# EAGLE design ESP8266_BREAKOUT (EAGLE 7.1.0)
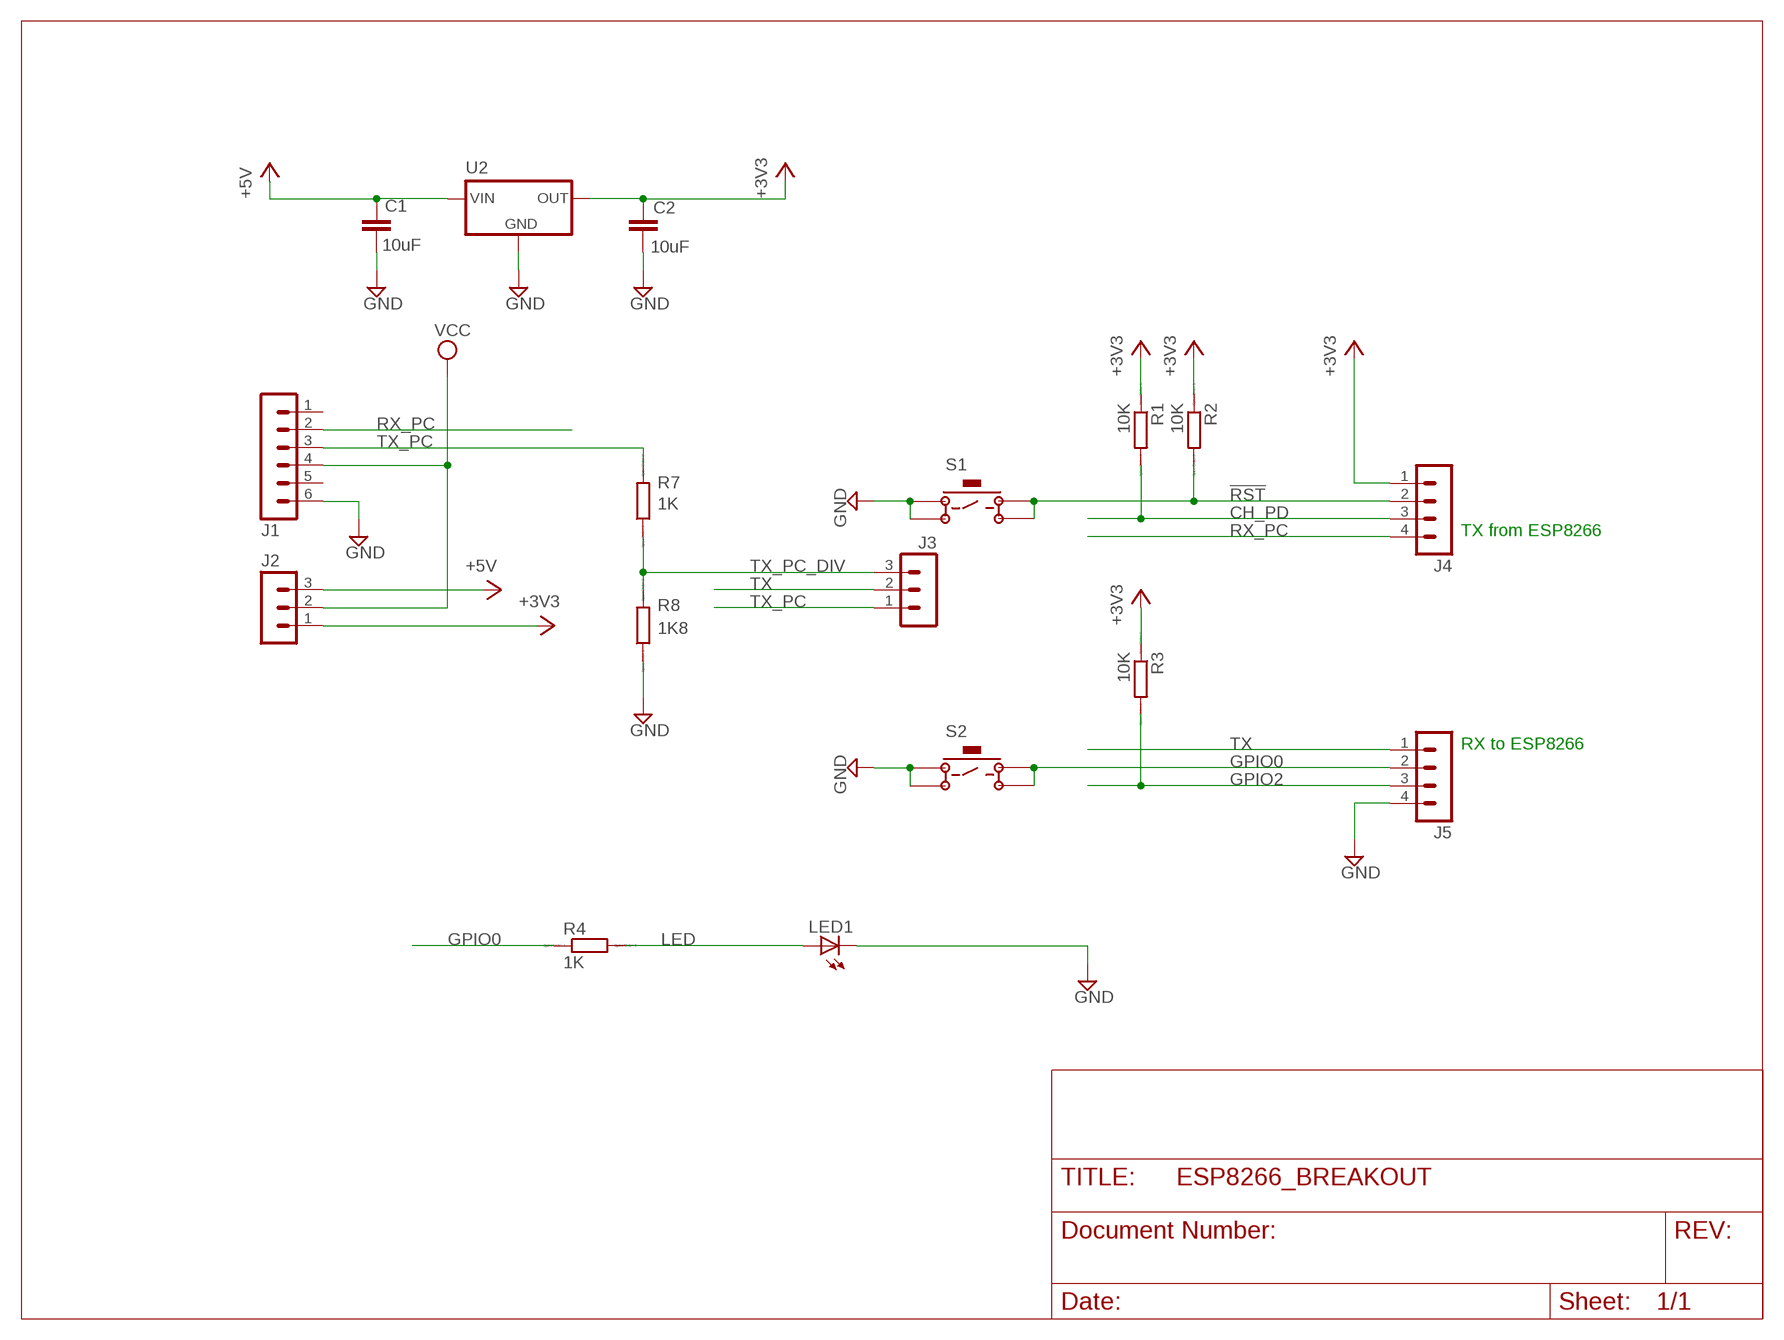
[diagram p0: schematic, sheet 1]

## Parts
C1  10uF  C5/2.5  [C5B2.5]
C2  10uF  C5/2.5  [C5B2.5]
J1  MA06-1  [MA06-1]
J2  MA03-1  [MA03-1]
J3  MA03-1  [MA03-1]
J4  MA04-1  [MA04-1]
J5  MA04-1  [MA04-1]
LED1  LED5MM  [LED5MM]
R1  10K  R-EU_0204_7  [0204/7]
R2  10K  R-EU_0204_7  [0204/7]
R3  10K  R-EU_0204_7  [0204/7]
R4  1K  R-EU_0204_7  [0204/7]
R7  1K  R-EU_0204_7  [0204/7]
R8  1K8  R-EU_0204_7  [0204/7]
S1  1825910-6-SPST-NOPB-4P  [SW-NOPB-4]
S2  1825910-6-SPST-NOPB-4P  [SW-NOPB-4]
U2  LM1117-3V3-T0-220  [TO-220]

## Nets
!RST: J4.2 R2.2 S1.3 S1.4
+3V3: C2.2 J2.1 J4.1 R1.1 R2.1 R3.1 U2.P$2(OUT)
+5V: C1.2 J2.3 U2.P$3(IN)
CH_PD: J4.3 R1.2
GND: C1.1 C2.1 J1.6 J5.4 LED1.K(C) R8.1 S1.1 S1.2 S2.1 S2.2 U2.P$1(GND)
GPIO0: J5.2 R4.1 S2.3 S2.4
GPIO2: J5.3 R3.2
LED: LED1.A R4.2
RX_PC: J1.2 J4.4
TX: J3.2 J5.1
TX_PC: J1.3 J3.1 R7.2
TX_PC_DIV: J3.3 R7.1 R8.2
VCC: J1.4 J2.2
Unconnected: J1.1 J1.5

## Notes on the sheet
- TX from ESP8266
- RX to ESP8266

## Library data of the parts
C1 C2 = capacitor-wima:C: CAPACITOR naming: grid - package width
J1 = con-lstb:MA06-1: PIN HEADER; OC_FARNELL: unknown; OC_NEWARK: unknown
J2 J3 = con-lstb:MA03-1: PIN HEADER; OC_FARNELL: unknown; OC_NEWARK: unknown
J4 J5 = con-lstb:MA04-1: PIN HEADER; OC_FARNELL: unknown; OC_NEWARK: unknown
LED1 = led:LED: LED OSRAM: - CHIPLED LG R971, LG N971, LY N971, LG Q971, LY Q971, LO R971, LY R971 LH N974, LH R974 LS Q976, LO Q976, LY Q976 LO Q996 - Hyper CHIPLED LW Q18S LB Q993, LB Q99A, LB R99A - SideLED LS A670, LO A670, LY A670, LG A670, LP A670 LB A673, LV A673, LT A673, LW A673 LH A674 LY A675 LS A676, LA A676, LO A676, LY A676, LW A676 LS A679, LY A679, LG A679 - Hyper Micro SIDELED® LS Y876, LA Y876, LO Y876, LY Y876 LT Y87S - SmartLED LW L88C, LW L88S LB L89C, LB L89S, LG L890 LS L89K, LO L89K, LY L89K LS L896, LA L896, LO L896, LY L896 - TOPLED LS T670, LO T670, LY T670, LG T670, LP T670 LSG T670, LSP T670, LSY T670, LOP T670, LYG T670 LG T671, LOG T671, LSG T671 LB T673, LV T673, LT T673, LW T673 LH T674 LS T676, LA T676, LO T676, LY T676, LB T676, LH T676, LSB T676, LW T676 LB T67C, LV T67C, LT T67C, LS T67K, LO T67K, LY T67K, LW E67C LS E67B, LA E67B, LO E67B, LY E67B, LB E67C, LV E67C, LT E67C LW T67C LS T679, LY T679, LG T679 LS T770, LO T770, LY T770, LG T770, LP T770 LB T773, LV T773, LT T773, LW T773 LH T774 LS E675, LA E675, LY E675, LS T675 LS T776, LA T776, LO T776, LY T776, LB T776 LHGB T686 LT T68C, LB T68C - Hyper Mini TOPLED® LB M676 - Mini TOPLED Santana® LG M470 LS M47K, LO M47K, LY M47K Source: http://www.osram.convergy.de LUXEON: - LUMILED® LXK2-PW12-R00, LXK2-PW12-S00, LXK2-PW14-U00, LXK2-PW14-V00 LXK2-PM12-R00, LXK2-PM12-S00, LXK2-PM14-U00 LXK2-PE12-Q00, LXK2-PE12-R00, LXK2-PE12-S00, LXK2-PE14-T00, LXK2-PE14-U00 LXK2-PB12-K00, LXK2-PB12-L00, LXK2-PB12-M00, LXK2-PB14-N00, LXK2-PB14-P00, LXK2-PB14-Q00 LXK2-PR12-L00, LXK2-PR12-M00, LXK2-PR14-Q00, LXK2-PR14-R00 LXK2-PD12-Q00, LXK2-PD12-R00, LXK2-PD12-S00 LXK2-PH12-R00, LXK2-PH12-S00 LXK2-PL12-P00, LXK2-PL12-Q00, LXK2-PL12-R00 Source: www.luxeon.com KINGBRIGHT: KA-3528ASYC Source: www.kingbright.com
R1-R4 R7 R8 = resistor:R-EU_: RESISTOR, European symbol; SPICEPREFIX: R
S1 S2 = 1825910-6:1825910-6-SPST-NOPB-4P
U2 = LM1117-3V3-TO220:LM1117-3V3-T0-220

## Board
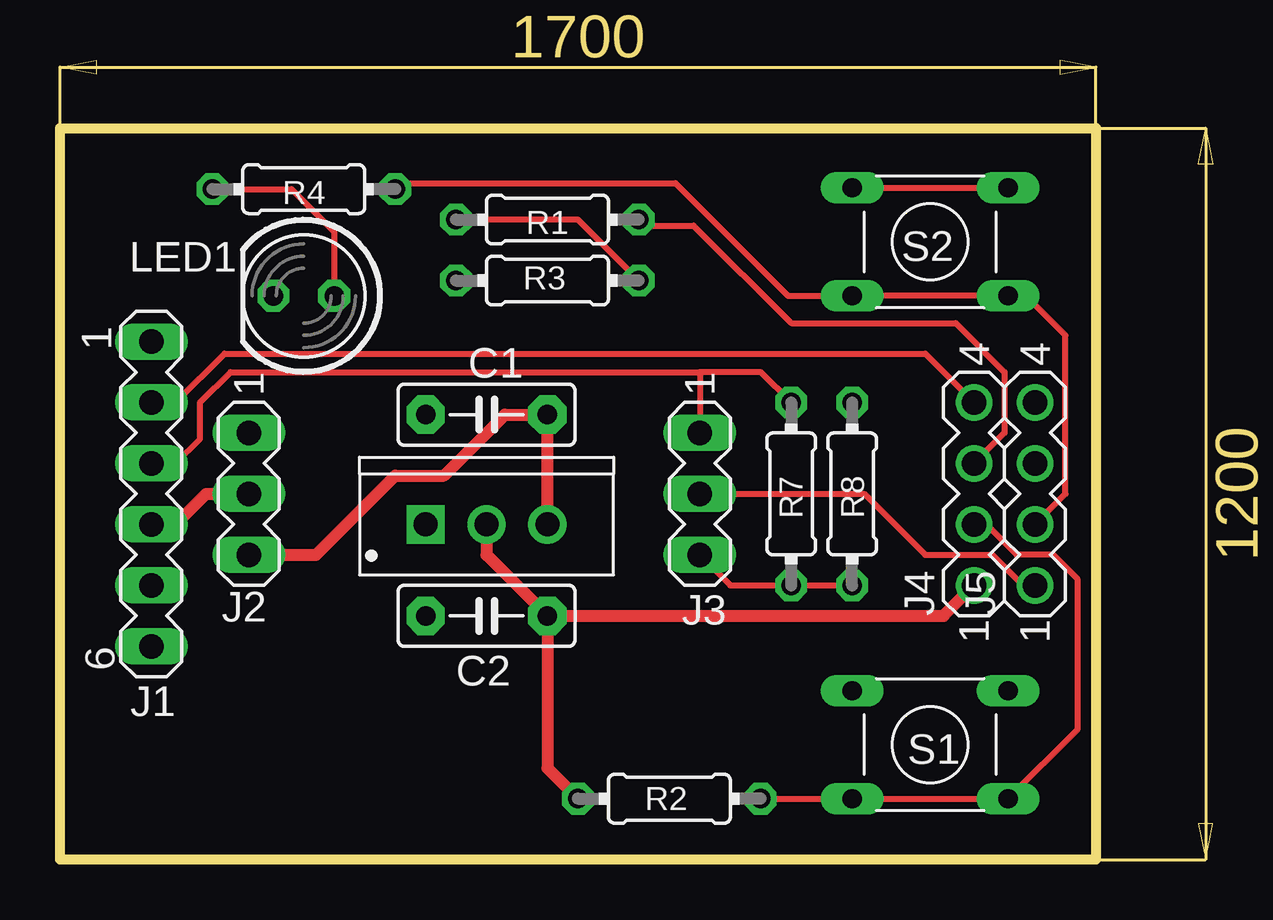
[diagram p1: board, top side]
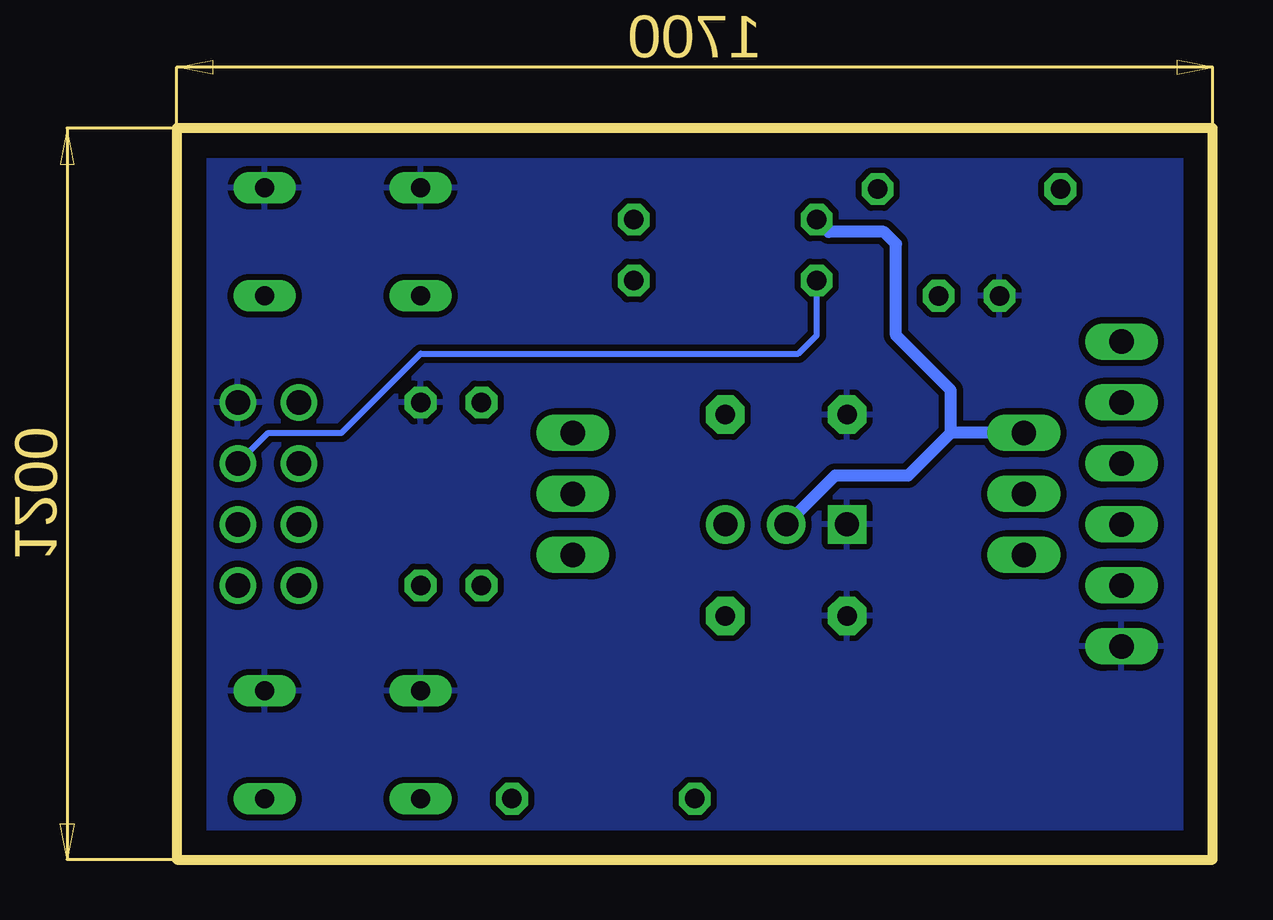
[diagram p2: board, bottom side, seen from below]

Size 43.18 x 30.48 mm. Coordinates in mm from the lower left corner, seen from the top.
Outline: 0,0 0,30.48 43.18,30.48 43.18,0 0,0
Copper layers (1*16): Top 0.035mm / dielectric 1.5mm / Bottom 0.035mm
Design rules "default *": minimum track width 10mil, minimum drill 24mil, track to track 10mil, track to pad 10mil, pad to pad 10mil, via to via 10mil, smd to smd 8mil, copper to edge 40mil, drill to drill 8mil, minimum pad ring 10mil, minimum via ring 8mil, stop-mask expansion 4mil, vias tented up to drill 0mil, thermal gap 10mil

### Footprints (pad centres in the part's own frame; a part is rotated, then mirrored left to right if it is on the bottom)
C5B2.5 = drill 0.813 pad 1.6 octagon: 1 -2.54,0; 2 2.54,0
MA06-1 = drill 1.016 long: 1 -6.35,0; 2 -3.81,0; 3 -1.27,0; 4 1.27,0; 5 3.81,0; 6 6.35,0
MA03-1 = drill 1.016 long: 1 -2.54,0; 2 0,0; 3 2.54,0
MA04-1 = drill 1.016: 1 -3.81,0; 2 -1.27,0; 3 1.27,0; 4 3.81,0
LED5MM = drill 0.813 octagon: A -1.27,0; K 1.27,0
0204/7 = drill 0.813 octagon: 1 -3.81,0; 2 3.81,0
SW-NOPB-4 = drill 0.8 pad 1.1 long: 1 0,4.5; 2 6.5,4.5; 3 0,0; 4 6.5,0
TO-220 = drill 1 pad 1.6 square: P$1 -2.54,0 | drill 1 pad 1.6: P$2 0,0; P$3 2.54,0

### Placement (x,y rotation side)
C1  17.78,18.54 0 top
C2  17.78,10.16 0 top
J1  3.81,15.24 270 top
J2  7.87,15.24 270 top
J3  26.67,15.24 270 top
J4  38.1,15.24 90 top
J5  40.64,15.24 90 top
LED1  10.16,23.5 180 top
R1  20.32,26.67 0 top
R2  25.4,2.54 0 top
R3  20.32,24.13 180 top
R4  10.16,27.94 180 top
R7  30.48,15.24 90 top
R8  33.02,15.24 270 top
S1  33.02,2.54 0 top
S2  33.02,23.5 0 top
U2  17.78,13.97 0 top

### Tracks (layer width: path | path; a pad name or v marks a point on that pad's centre or on a via)
!RST
  Top 0.254: R2.2 S1.3 S1.4 42.42,5.44 42.42,11.68 41.4,12.7 39.88,12.7 38.61,13.97 J4.2
+3V3
  Top 0.254: R3.1 21.59,26.67 R1.1
  Top 0.508: C2.2 20.32,3.81 R2.1 | C2.2 36.83,10.16 J4.1 | U2.P$2 17.78,12.7 C2.2
  Bottom 0.508: J2.1 10.92,17.78 | 10.92,17.78 12.7,16 15.75,16 U2.P$2 | 10.92,17.78 10.92,19.56 13.21,21.84 13.21,25.65 13.72,26.16 16,26.16 R1.1
+5V
  Top 0.508: U2.P$3 C1.2 18.54,18.54 16,16 13.97,16 10.67,12.7 J2.3
CH_PD
  Top 0.254: R1.2 24.38,26.42 26.42,26.42 30.48,22.35 37.34,22.35 39.37,20.32 39.37,17.78 J4.3
GND
  Top 0.254: S2.1 S2.2
  pour Bottom: 42.16,29.46 1.02,29.46 1.02,1.02 41.15,1.02 42.16,1.02
GPIO0
  Top 0.254: R4.1 14.22,28.19 25.65,28.19 30.35,23.5 S2.3 S2.4 40.26,23.5 41.91,21.84 41.91,15.24 J5.2
GPIO2
  Bottom 0.254: J5.3 39.37,17.78 36.32,17.78 33.02,21.08 17.27,21.08 16.51,21.84 R3.2
LED
  Top 0.254: R4.2 9.65,27.94 11.43,26.16 LED1.A
RX_PC
  Top 0.254: J4.4 36.07,21.08 6.86,21.08 4.83,19.05 J1.2
TX
  Top 0.254: J3.2 33.53,15.24 36.07,12.7 38.86,12.7 40.13,11.43 J5.1
TX_PC
  Top 0.254: J1.3 4.83,16.51 5.84,17.53 5.84,19.05 7.11,20.32 26.67,20.32 | 26.67,20.32 J3.1 | R7.2 29.21,20.32 26.67,20.32
TX_PC_DIV
  Top 0.254: J3.3 27.94,11.43 R7.1 R8.2
VCC
  Top 0.508: J1.4 4.83,13.97 6.1,15.24 J2.2